# Altium schematic sheet voltaje regulator.SchDoc
size A4; Address1: hola
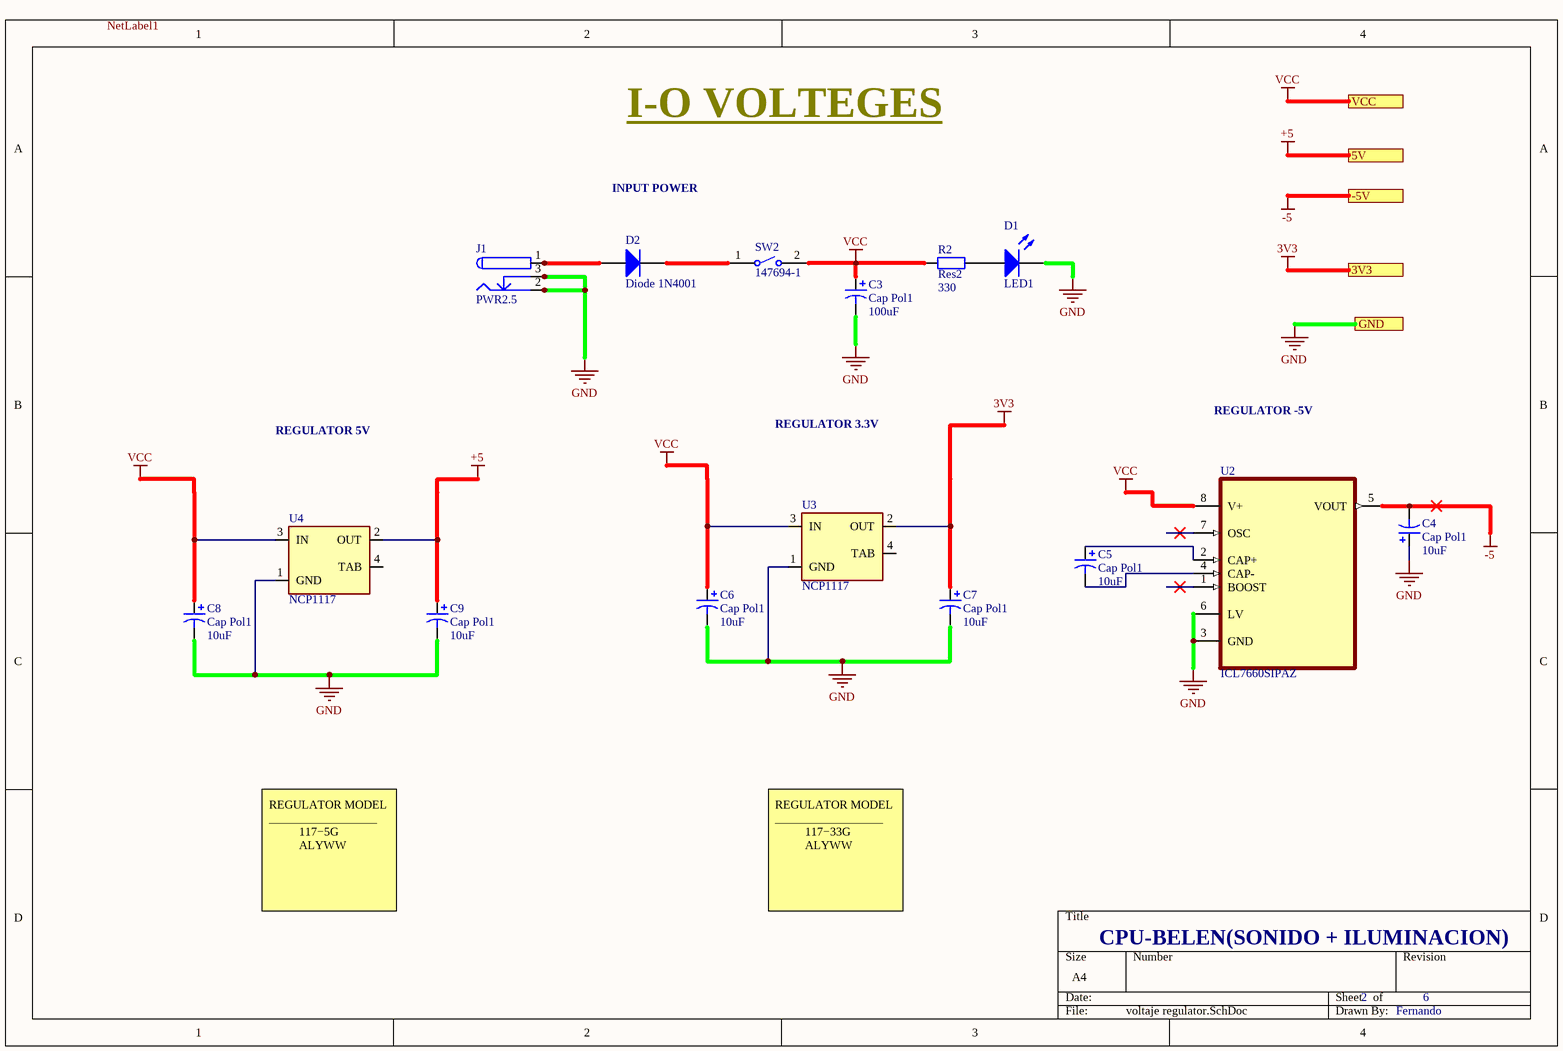
[diagram p0: voltaje regulator.SchDoc]

## Parts
C3  Cap Pol1  value 100uF  [RB7.6-15]
C4  Cap Pol1  value 10uF  [RB7.6-15]
C5  Cap Pol1  value 10uF  [RB7.6-15]
C6  Cap Pol1  value 10uF  [RB7.6-15]
C7  Cap Pol1  value 10uF  [RB7.6-15]
C8  Cap Pol1  value 10uF  [RB7.6-15]
C9  Cap Pol1  value 10uF  [RB7.6-15]
D1  LED1  [LED-1]
D2  Diode 1N4001  [DO-41]
J1  PWR2.5  [KLD-0202]
R2  Res2  value 330  [AXIAL-0.4]
SW2  147694-1  [TE_FSM8JRT]
U2  ICL7660SIPAZ  [DIP254P762X533-8]
U3  NCP1117  [SOT223]
U4  NCP1117  [SOT223]

## Ports
3V3, 5V, -5V, GND, VCC

## Nets
3V3: C7.1 U3.2(OUT) ; port 3V3
+5: C9.1 U4.2(OUT) ; port 5V
-5: C4.2 U2.5(VOUT) ; port -5V
GND: C3.2 C4.1 C6.2 C7.2 C8.2 C9.2 D1.2(K) J1.2 J1.2A J1.2B J1.3 J1.3A J1.3B U2.3(GND) U2.6(LV) U3.1(GND) U4.1(GND) ; port GND
VCC: C3.1 C6.1 C8.1 R2.1 SW2.2 U2.8(V+) U3.3(IN) U4.3(IN) ; port VCC
NetC5_1: C5.1 U2.2(CAP+)
NetC5_2: C5.2 U2.4(CAP-)
NetD1_1: D1.1(A) R2.2
NetD2_1: D2.1(A) J1.1 J1.1A J1.1B
NetD2_2: D2.2(K) SW2.1

Not connected (* = marked no-connect by the designer): U2 1(BOOST)* 7(OSC)*; U3 4(TAB); U4 4(TAB)

## Notes on the sheet
- I-O VOLTEGES
- INPUT POWER
- REGULATOR 5V
- REGULATOR 3.3V
- REGULATOR -5V
- REGULATOR MODEL
  __________________
  117−5G
  ALYWW
- REGULATOR MODEL
  __________________
  117−33G
  ALYWW
- CPU-BELEN(SONIDO + ILUMINACION)
- 2
- 6
- Fernando
- Labels drawn without touching a wire or pin: NetLabel1

## Library data of the parts
C3-C9 = Cap Pol1: Polarized Capacitor (Radial); Published: 8-Jun-2000; LatestRevisionDate: 17-Jul-2002; LatestRevisionNote: Re-released for DXP Platform.; PackageReference: RB7.6-15; Publisher: Altium Limited; PackageDescription: Polarized Capacitor (Radial); 2 Leads
D1 = LED1: Typical RED GaAs LED; Published: 8-Jun-2000; LatestRevisionDate: 08-Jul-2005; LatestRevisionNote: Mech Layer 1 removed.; PackageReference: LED-1; Publisher: Altium Limited; PackageDescription: LED; 2 Leads
D2 = Diode 1N4001: 1 Amp General Purpose Rectifier; Published: 8-Jun-2000; LatestRevisionDate: 17-Jul-2002; LatestRevisionNote: Re-released for DXP Platform.; DatasheetVersion: 1998; PackageVersion: Aug-1999; PackageReference: DO-41; Publisher: Altium Limited; PackageDescription: Diode, Axial; Body 5.2 x 2.7 mm (LxDia. max), Lead Dia. 0.86 mm (max); Code_JEDEC: DO-204-AL; ComponentLink1Description: Manufacturer Link; ComponentLink1URL: http://www.fairchildsemi.com/; ComponentLink2Description: Datasheet; ComponentLink2URL: http://www.fairchildsemi.com/ds/1N%2F1N4001.pdf
J1 = PWR2.5: Low Voltage Power Supply Connector; Published: 17-Dec-2003; DatasheetDocument: 09-May-2002; Publisher: Altium Limited; ComponentLink1Description: Manufacturer Link; ComponentLink1URL: http://domino.kycon.com/internet/Products.html
R2 = Res2: Resistor; Published: 8-Jun-2000; LatestRevisionDate: 17-Jul-2002; LatestRevisionNote: Re-released for DXP Platform.; PackageReference: AXIAL-0.4; Publisher: Altium Limited; PackageDescription: Axial Device, Thru-Hole; 2 Leads; 0.4 in Pin Spacing
SW2 = 147694-1: Tactile Switch SPST-NO Top Actuated Through Hole; MF: TE Connectivity; Configuration_Pole-Throw: Single Pole - Single Throw; Contact_Current_Rating: 50 mA; Value: *; Package: None; MP: 147694-1; Price: None; Availability: Unavailable; SnapEDA_Link: https://www.snapeda.com/parts/147694-1/TE%20Connectivity%20ALCOSWITCH%20Switches/view-part/445965/?ref=snap; EU_RoHS_Compliance: Compliant; TE_purchase_URL: https://www.te.com/usa-en/product-147694-1.html?te_bu=Cor&te_type=disp&te_campaign=seda_glo_cor-seda-global-disp-prtnr-fy19-seda-model-bom-cta_sma-317_1&elqCampaignId=32493
U2 = ICL7660SIPAZ: Charge Pump Switching Regulator IC Positive or Negative Fixed -Vin, 2Vin 1 Output 45mA 8-DIP _0.300, 7.62mm_; MF: Renesas Electronics; Price: None; Availability: Unavailable; Package: DIP-8 Intersil; MP: ICL7660SIPAZ; Value: *; SnapEDA_Link: https://www.snapeda.com/parts/ICL7660SIPAZ/Renesas%20Electronics%20America%20Inc./view-part/47938/?ref=snap
U3 U4 = NCP1117: Linear Voltage Regulator IC 1 Output 1A DPAK; MF: ON Semiconductor; MP: NCP1117; Package: TO-252-3 ON Semiconductor; Price: None; Availability: Unavailable; Value: *; SnapEDA_Link: https://www.snapeda.com/parts/NCP1117/ON%20Semiconductor/view-part/558520/?ref=snap